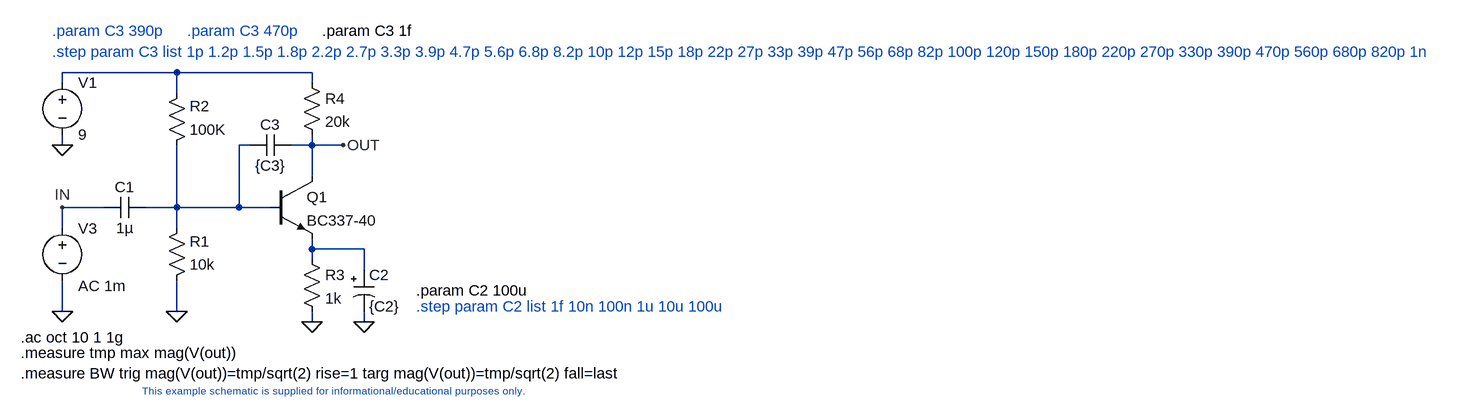
[diagram p0: schematic MeasureBW.asc]
MeasureBW.asc, the LTspice schematic file:
Version 4
SHEET 1 2928 1936
WIRE 192 1152 16 1152
WIRE 400 1152 192 1152
WIRE 16 1168 16 1152
WIRE 400 1168 400 1152
WIRE 192 1184 192 1152
WIRE 16 1264 16 1248
WIRE 304 1264 288 1264
WIRE 400 1264 400 1248
WIRE 400 1264 368 1264
WIRE 448 1264 400 1264
WIRE 400 1312 400 1264
WIRE 80 1360 16 1360
WIRE 192 1360 192 1264
WIRE 192 1360 144 1360
WIRE 288 1360 288 1264
WIRE 288 1360 192 1360
WIRE 336 1360 288 1360
WIRE 16 1392 16 1360
WIRE 192 1392 192 1360
WIRE 400 1424 400 1408
WIRE 480 1424 400 1424
WIRE 400 1440 400 1424
WIRE 480 1456 480 1424
WIRE 16 1520 16 1472
WIRE 192 1520 192 1472
WIRE 400 1536 400 1520
WIRE 480 1536 480 1520
FLAG 16 1520 0
FLAG 16 1360 IN
FLAG 192 1520 0
FLAG 400 1536 0
FLAG 448 1264 OUT
FLAG 16 1264 0
FLAG 480 1536 0
SYMBOL npn 336 1312 R0
SYMATTR InstName Q1
SYMATTR Value BC337-40
SYMBOL res 384 1424 R0
SYMATTR InstName R3
SYMATTR Value 1k
SYMBOL voltage 16 1376 R0
WINDOW 123 24 105 Left 2
WINDOW 39 0 0 Left 2
SYMATTR Value2 AC 1m
SYMATTR InstName V3
SYMATTR Value ""
SYMBOL res 176 1488 M180
WINDOW 0 36 76 Left 2
WINDOW 3 36 40 Left 2
SYMATTR InstName R1
SYMATTR Value 10k
SYMBOL cap 144 1344 R90
WINDOW 0 0 32 VBottom 2
WINDOW 3 32 32 VTop 2
SYMATTR InstName C1
SYMATTR Value 1µ
SYMBOL res 176 1280 M180
WINDOW 0 36 76 Left 2
WINDOW 3 36 40 Left 2
SYMATTR InstName R2
SYMATTR Value 100K
SYMBOL voltage 16 1152 R0
WINDOW 123 0 0 Left 2
WINDOW 39 0 0 Left 2
SYMATTR InstName V1
SYMATTR Value 9
SYMBOL polcap 464 1456 R0
WINDOW 3 24 56 Left 2
SYMATTR Value {C2}
SYMATTR InstName C2
SYMATTR Description Capacitor
SYMATTR Type cap
SYMBOL res 384 1152 R0
SYMATTR InstName R4
SYMATTR Value 20k
SYMBOL cap 368 1248 R90
WINDOW 0 0 32 VBottom 2
WINDOW 3 32 32 VTop 2
SYMATTR InstName C3
SYMATTR Value {C3}
TEXT -48 1560 Left 2 !.ac oct 10 1 1g
TEXT 424 1632 Top 1 ;This example schematic is supplied for informational/educational purposes only.
TEXT -48 1584 Left 2 !.measure tmp max mag(V(out))\n.measure BW trig mag(V(out))=tmp/sqrt(2) rise=1 targ mag(V(out))=tmp/sqrt(2) fall=last
TEXT 560 1512 Left 2 ;.step param C2 list 1f 10n 100n 1u 10u 100u
TEXT 560 1488 Left 2 !.param C2 100u
TEXT 0 1088 Left 2 ;.param C3 390p
TEXT 0 1120 Left 2 ;.step param C3 list 1p 1.2p 1.5p 1.8p 2.2p 2.7p 3.3p 3.9p 4.7p 5.6p 6.8p 8.2p 10p 12p 15p 18p 22p 27p 33p 39p 47p 56p 68p 82p 100p 120p 150p 180p 220p 270p 330p 390p 470p 560p 680p 820p 1n
TEXT 208 1088 Left 2 ;.param C3 470p
TEXT 416 1088 Left 2 !.param C3 1f

The netlist it stands for:
* MeasureBW.asc
Q1 OUT N002 N003 0 BC337-40
R3 N003 0 1k
V3 IN 0 AC 1m
R1 0 N002 10k
C1 N002 IN 1µ
R2 N002 N001 100K
V1 N001 0 9
C2 N003 0 {C2}
R4 N001 OUT 20k
C3 OUT N002 {C3}
.model NPN NPN
.model PNP PNP
.lib standard.bjt
.ac oct 10 1 1g
* This example schematic is supplied for informational/educational purposes only.
.measure tmp max mag(V(out))
.measure BW trig mag(V(out))=tmp/sqrt(2) rise=1 targ mag(V(out))=tmp/sqrt(2) fall=last
* .step param C2 list 1f 10n 100n 1u 10u 100u
.param C2 100u
* .param C3 390p
* .step param C3 list 1p 1.2p 1.5p 1.8p 2.2p 2.7p 3.3p 3.9p 4.7p 5.6p 6.8p 8.2p 10p 12p 15p 18p 22p 27p 33p 39p 47p 56p 68p 82p 100p 120p 150p 180p 220p 270p 330p 390p 470p 560p 680p 820p 1n
* .param C3 470p
.param C3 1f
.backanno
.end